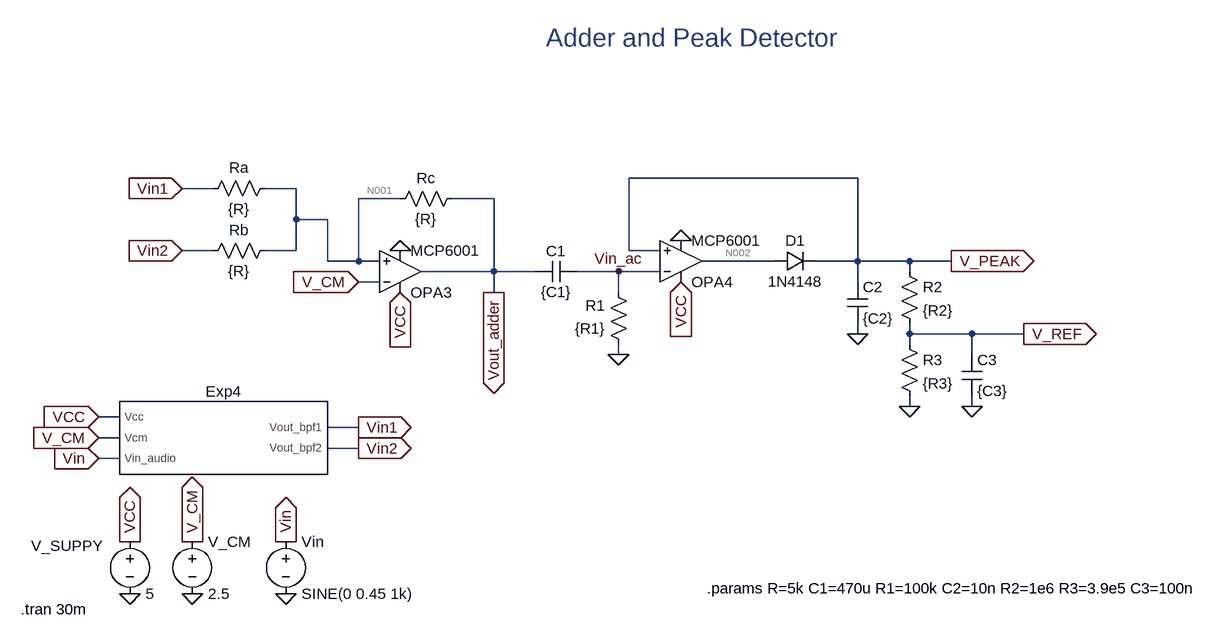
[diagram p0: schematic Exp7.asc]
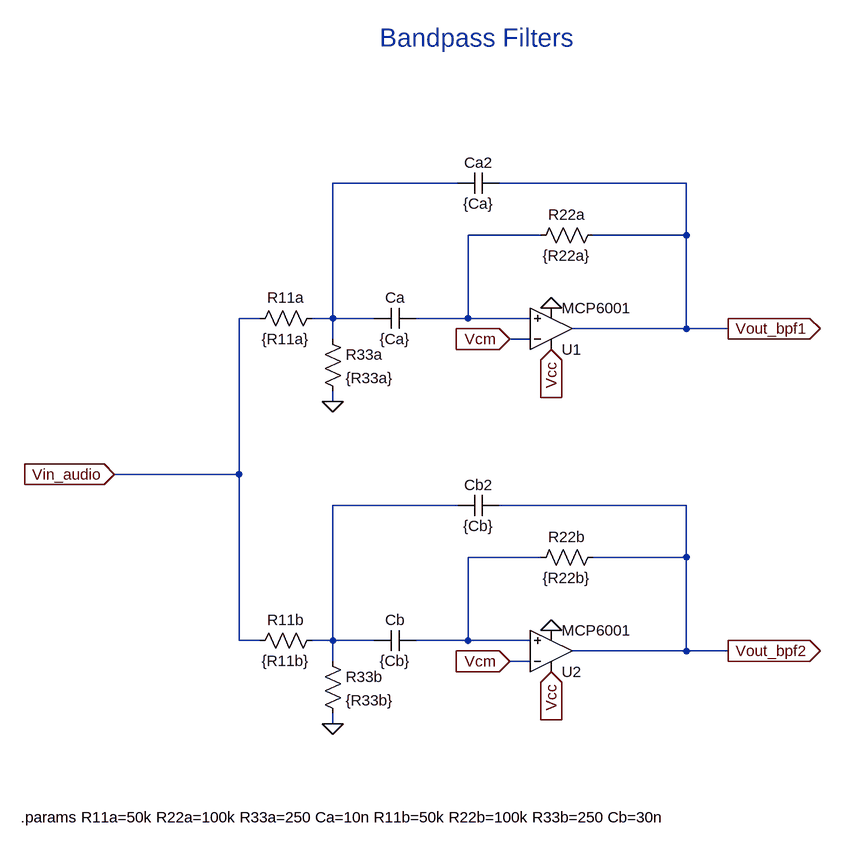
[diagram p1: sub-circuit p6_instance.asc]
* Exp7.asc
* OPA3: MCP6001 (symbol Ext_models\MCP6001 not available, pins judged from their places): In+=N001 In-=V_CM V+=VCC V-=0 OUT=Vout_adder
* OPA4: MCP6001 (symbol Ext_models\MCP6001 not available, pins judged from their places): In+=V_PEAK In-=Vin_ac V+=VCC V-=0 OUT=N002
Ra N001 Vin1 {R}
Rb N001 Vin2 {R}
Rc Vout_adder N001 {R}
R1 0 Vin_ac {R1}
C1 Vin_ac Vout_adder {C1}
C2 V_PEAK 0 {C2}
C3 V_REF 0 {C3}
R3 V_REF 0 {R3}
R2 V_PEAK V_REF {R2}
D1 N002 V_PEAK 1N4148
X§Exp4 VCC V_CM Vin Vin1 Vin2 p6_instance
V_SUPPY VCC 0 5
V_CM V_CM 0 2.5
Vin Vin 0 SINE(0 0.45 1k)

* block symbol definitions
.subckt p6_instance Vcc Vcm Vin_audio Vout_bpf1 Vout_bpf2
* U1: MCP6001 (symbol Ext_models\MCP6001 not available, pins judged from their places): In+=N002 In-=Vcm V+=Vcc V-=0 OUT=Vout_bpf1
Ca N002 N001 {Ca}
Ca2 Vout_bpf1 N001 {Ca}
R11a N001 Vin_audio {R11a}
R22a Vout_bpf1 N002 {R22a}
R33a N001 0 {R33a}
* U2: MCP6001 (symbol Ext_models\MCP6001 not available, pins judged from their places): In+=N004 In-=Vcm V+=Vcc V-=0 OUT=Vout_bpf2
Cb N004 N003 {Cb}
Cb2 Vout_bpf2 N003 {Cb}
R11b N003 Vin_audio {R11b}
R22b Vout_bpf2 N004 {R22b}
R33b N003 0 {R33b}
.params R11a=50k R22a=100k R33a=250 Ca=10n R11b=50k R22b=100k R33b=250 Cb=30n
* Bandpass Filters
.ends p6_instance

.model D D
.lib standard.dio
.params R=5k C1=470u R1=100k C2=10n R2=1e6 R3=3.9e5 C3=100n
* Adder and Peak Detector
.tran 30m
.backanno
.end

* Results of the author's LTspice run, read from the files saved beside the schematic
* Operating Point, zero values left out:
*   V(n001) = 2.501 V
*   V(vout_adder) = 2.501 V
*   V(vin_ac) = 25.12 nV
*   V(n002) = 10.38 mV
*   V(v_ref) = 230.8 µV
*   V(v_cm) = 2.5 V
*   V(vcc) = 5 V
*   V(v_peak) = 822.7 µV
*   V(vin1) = 2.501 V
*   V(vin2) = 2.501 V
*   I(R3) = 591.9 pA
*   I(V_SUPPY) = -541 µA
*   I(R2) = 591.9 pA
*   I(D1) = 591.6 pA
*   Ix(opa4:3) = 104.1 µA
*   Ix(opa4:4) = -104.1 µA
*   Ix(opa4:5) = -591.6 pA
*   Ix(exp4:vcc) = 291.3 µA
*   Ix(opa3:3) = 145.6 µA
*   Ix(opa3:4) = -145.6 µA
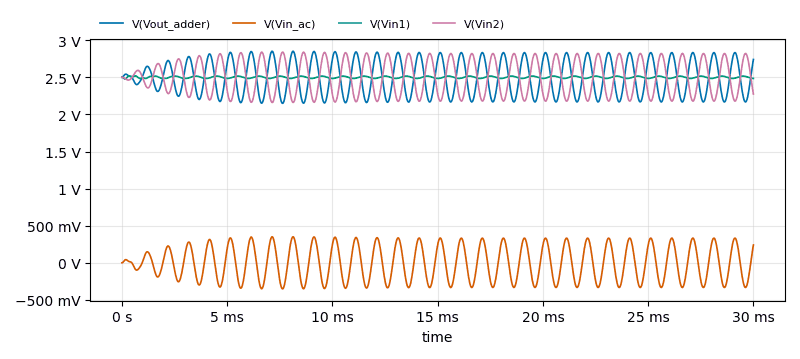
[diagram p2: Transient Analysis of Exp7.asc, plotted from the saved traces]
* Transient Analysis, 1 run:
*   V(Vout_adder): min 2.15 V, max 2.852 V, average 2.499 V, rms 2.51 V, last 2.741 V
*   V(Vin_ac): min -350.8 mV, max 351.1 mV, average -1.228 mV, rms 228 mV, last 240.5 mV
*   V(Vin1): min 2.478 V, max 2.52 V, average 2.501 V, rms 2.501 V, last 2.485 V
*   V(Vin2): min 2.16 V, max 2.841 V, average 2.502 V, rms 2.512 V, last 2.275 V